# EAGLE design Final_Schematic_PCB (EAGLE 7.2.0)
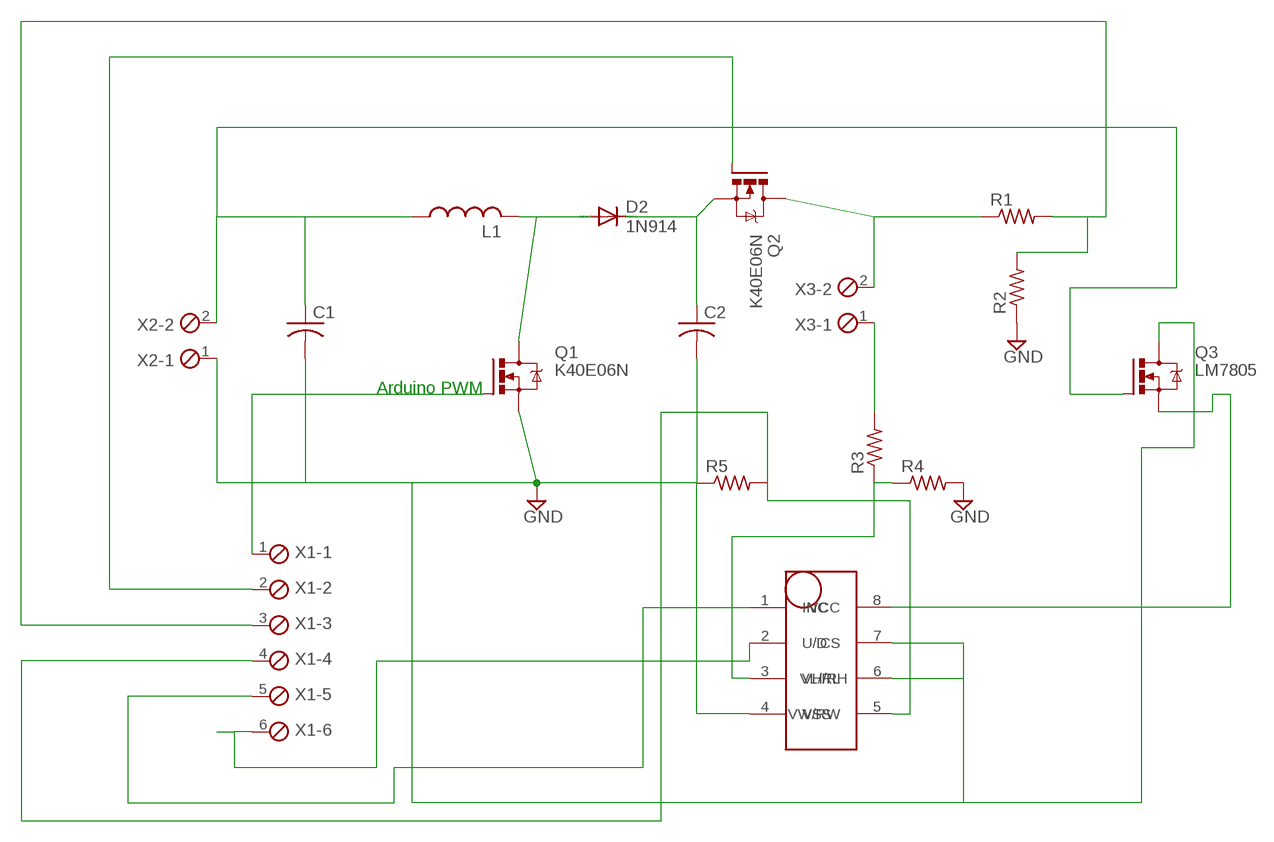
[diagram p0: schematic, sheet 1]

## Parts
C1  C-US050-045X075  [C050-045X075]
C2  C-US050-045X075  [C050-045X075]
D2  1N914  1N4933  [DO41-10]
L1  L-US0207/5V  [0207/5V]
Q1  K40E06N  IRF530  [TO220BV]
Q2  K40E06N  IRF530  [TO220BV]
Q3  LM7805  IRF530  [TO220BV]
R1  R-US_0204/5  [0204/5]
R2  R-US_0204/5  [0204/5]
R3  R-US_0204/5  [0204/5]
R4  R-US_0204/5  [0204/5]
R5  R-US_0204/5  [0204/5]
U$1  1KDP  [1KDP]
X1  MPT6  [6POL254]
X2  MPT2  [2POL254]
X3  MPT2  [2POL254]

## Nets
GND: C1.2 C2.2 Q1.S Q3.D R2.1 R4.2 R5.1 U$1.4(VSS) U$1.6(VL/RL) U$1.7(CS) X2.1
N$1: C1.1 L1.1 Q3.G X2.2
N$2: D2.A L1.2 Q1.D
N$3: C2.1 D2.C Q2.S
N$4: R1.2 R2.2 X1.3
N$5: Q3.S U$1.8(VCC)
N$6: Q2.D R1.1 X3.2
N$7: R3.2 X3.1
N$8: R3.1 R4.1 U$1.3(VH/RH)
N$9: R5.2 U$1.5(VW/RW) X1.4
N$11: Q1.G X1.1
N$13: Q2.G X1.2
N$16: U$1.1(INC) X1.5
N$17: U$1.2(U/D) X1.6

## Notes on the sheet
- Arduino PWM

## Library data of the parts
C1 C2 = rcl:C-US: CAPACITOR, American symbol
D2 = diode:1N4933: DIODE fast recovery rectifier, 1A
L1 = rcl:L-US: INDUCTOR, American symbol
Q1-Q3 = transistor-power:IRF530: HEXFET Power MOSFET
R1-R5 = rcl:R-US_: RESISTOR, American symbol
U$1 = DigitalPot:1KDP
X1 = con-phoenix-254:MPT6: PHOENIX CONNECTOR; OC_FARNELL: unknown; OC_NEWARK: unknown
X2 X3 = con-phoenix-254:MPT2: PHOENIX CONNECTOR; OC_FARNELL: unknown; OC_NEWARK: unknown

## Board
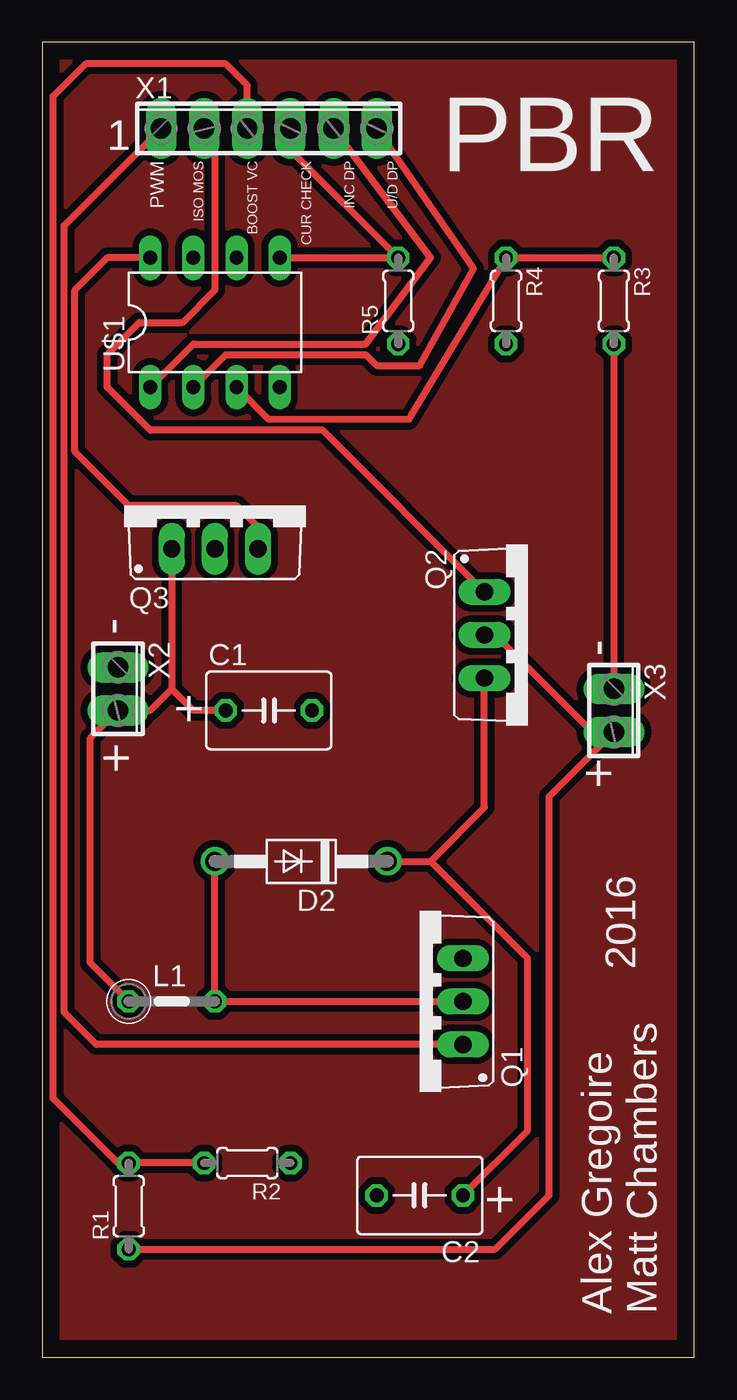
[diagram p1: board, top side]
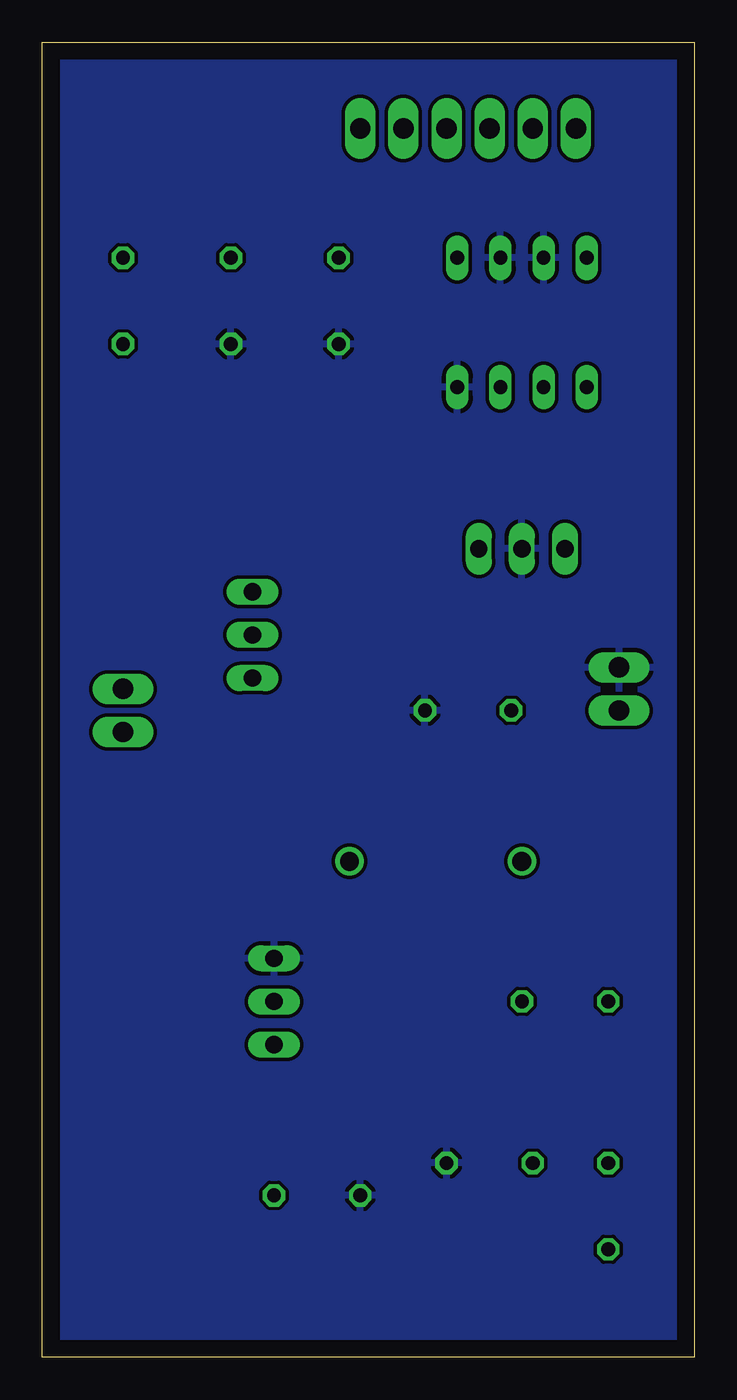
[diagram p2: board, bottom side, seen from below]

Size 38.41 x 77.46 mm. Coordinates in mm from the lower left corner, seen from the top.
Outline: 0,0 38.41,0 38.41,77.46 0,77.46 0,0
Copper layers (1*16): Top 0.035mm / dielectric 1.5mm / GND 0.035mm
Design rules "default": minimum track width 10mil, minimum drill 24mil, track to track 8mil, track to pad 8mil, pad to pad 8mil, via to via 8mil, smd to smd 8mil, copper to edge 40mil, drill to drill 8mil, minimum pad ring 10mil, minimum via ring 8mil, stop-mask expansion 4mil, vias tented up to drill 0mil, thermal gap 10mil

### Footprints (pad centres in the part's own frame; a part is rotated, then mirrored left to right if it is on the bottom)
C050-045X075 = drill 0.813 octagon: 1 -2.54,0; 2 2.54,0
DO41-10 = drill 1.118: A 5.08,0; C -5.08,0
0207/5V = drill 0.813 octagon: 1 -2.54,0; 2 2.54,0
TO220BV = drill 1.016 long: D 0,-2.54; G -2.54,-2.54; S 2.54,-2.54
0204/5 = drill 0.813 octagon: 1 -2.54,0; 2 2.54,0
1KDP = drill 0.813 long: 1 -3.81,-3.81; 2 -1.27,-3.81; 3 1.27,-3.81; 4 3.81,-3.81; 5 3.81,3.81; 6 1.27,3.81; 7 -1.27,3.81; 8 -3.81,3.81
6POL254 = drill 1.2 pad 1.778 long: 1 -6.35,0; 2 -3.81,0; 3 -1.27,0; 4 1.27,0; 5 3.81,0; 6 6.35,0
2POL254 = drill 1.2 long: 1 -1.27,0; 2 1.27,0

### Placement (x,y rotation side)
C1  13.34,38.1 0 top
C2  22.22,9.53 180 top
D2  15.24,29.21 180 top
L1  7.62,20.95 0 top
Q1  22.22,20.95 90 top
Q2  28.57,42.55 270 top
Q3  10.16,50.16 0 top
R1  5.08,8.89 90 top
R2  12.06,11.43 180 top
R3  33.66,62.23 270 top
R4  27.3,62.23 270 top
R5  20.95,62.23 90 top
U$1  10.16,60.96 0 top
X1  13.34,72.39 0 top
X2  4.45,39.37 270 top
X3  33.66,38.1 270 top

### Tracks (layer width: path | path; a pad name or v marks a point on that pad's centre or on a via)
GND
  pour GND: 0.64,0.64 37.47,0.64 37.47,76.83 0.64,76.83
  pour GND (isolate 0.406): 1.27,76.2 1.27,1.27 37.47,1.27 37.47,76.2
N$1
  Top 0.406: Q3.G 7.62,39.37 | 7.62,39.37 6.35,38.1 X2.2 2.82,36.48 2.82,23.21 L1.1 | C1.1 8.89,38.1 7.62,39.37
N$2
  Top 0.406: Q1.D L1.2 D2.A
N$3
  Top 0.406: D2.C 22.86,29.21 | 22.86,29.21 26.04,32.39 Q2.S | C2.1 28.57,13.34 28.57,23.49 22.86,29.21
N$4
  Top 0.406: R2.2 R1.2 4.45,11.43 0.64,15.24 0.64,74.3 2.54,76.2 10.79,76.2 12.06,74.93 X1.3
N$5
  Top 0.406: Q3.S 12.7,48.9 11.43,50.16 5.08,50.16 1.91,53.34 1.91,62.87 3.81,64.77 U$1.8
N$6
  Top 0.406: Q2.D 26.67,42.55 32.39,36.83 X3.2 29.84,33.02 29.84,9.53 26.67,6.35 R1.1
N$7
  Top 0.406: R3.2 X3.1
N$8
  Top 0.406: R3.1 R4.1 21.59,55.25 13.34,55.25 U$1.3
N$9
  Top 0.406: X1.4 14.61,71.12 R5.2 U$1.5
N$10
  pour Top (isolate 0.406): 38.73,0 0,0 0,77.47 38.73,77.47
N$11
  Top 0.406: X1.1 1.27,66.67 1.27,20.32 3.17,18.41 Q1.G
N$13
  Top 0.406: X1.2 10.16,71.75 10.16,62.87 8.26,60.96 5.71,60.96 3.81,59.05 3.81,57.15 6.35,54.61 16.51,54.61 Q2.G
N$16
  Top 0.406: U$1.1 8.89,59.69 19.05,59.69 22.86,64.77 X1.5
N$17
  Top 0.406: U$1.2 10.79,59.05 19.05,59.05 19.68,58.42 22.22,58.42 25.4,64.13 X1.6

### Text on the board
tNames: 1 | PWM | ISO MOS | BOOST VC | CUR CHECK | INC DP | U/D DP | PBR | - | - | + | + | + | 2016 | + | Alex Gregoire / Matt Chambers